# EAGLE design mute control (EAGLE 7.3.0)
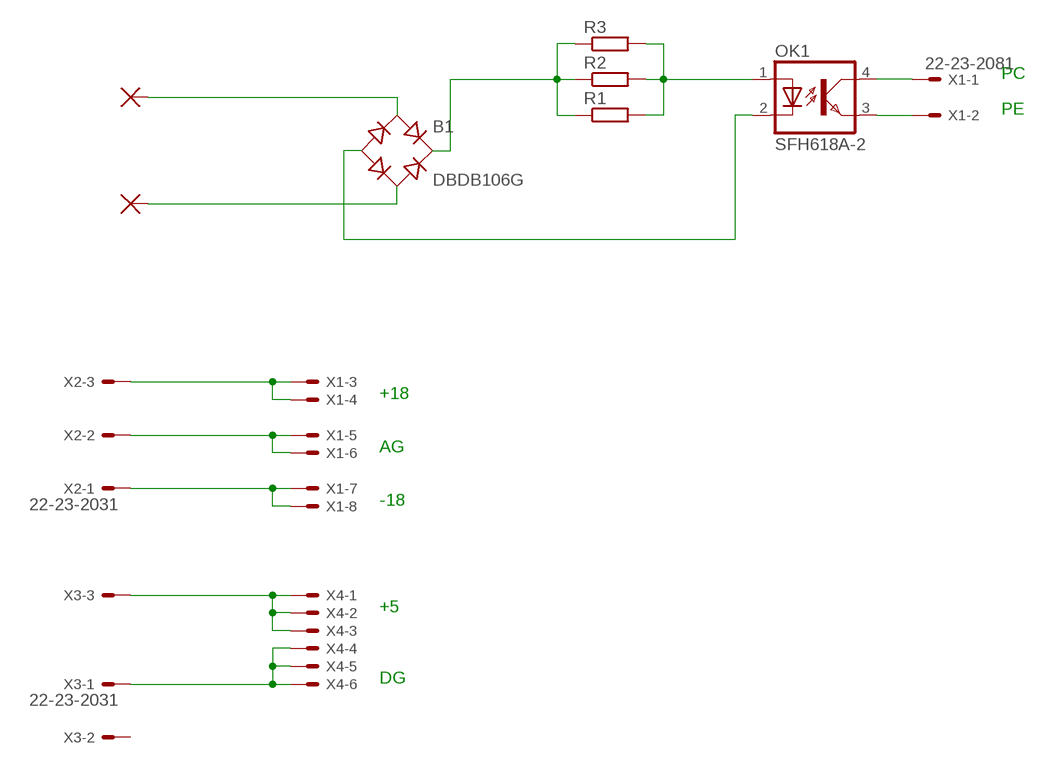
[diagram p0: schematic, sheet 1]

## Parts
AC  3,17/1,3  [OBLONG]
B1  DBDB106G  [DB]
OK1  SFH618A-2  [DIP4]
PAD1  3,17/1,3  [OBLONG]
R1  R-EU_0817/22  [P0817/22]
R2  R-EU_0817/22  [P0817/22]
R3  R-EU_0817/22  [P0817/22]
X1  22-23-2081  [22-23-2081]
X2  22-23-2031  [22-23-2031]
X3  22-23-2031  [22-23-2031]
X4  22-23-2061  [22-23-2061]

## Nets
N$1: AC.P$1(P) B1.AC2
N$2: B1.AC1 PAD1.P$1(P)
N$3: B1.+ R1.1 R2.1 R3.1
N$4: B1.- OK1.2(C)
N$5: OK1.4(COL) X1.1
N$6: OK1.3(EMIT) X1.2
N$7: X1.3 X1.4 X2.3
N$8: OK1.1(A) R1.2 R2.2 R3.2
N$9: X3.1 X4.4 X4.5 X4.6
N$10: X3.3 X4.1 X4.2 X4.3
N$11: X1.5 X1.6 X2.2
N$12: X1.7 X1.8 X2.1
Unconnected: X3.2

## Notes on the sheet
- PC
- PE
- +18
- AG
- -18
- +5
- DG

## Library data of the parts
AC PAD1 = wirepad:3,17/1,3: THROUGH-HOLE PAD
B1 = rectifier:DB?*G: Single Phase 1.0 AMP Glass Passivated Bridge Rectifier Taiwan Semiconductor Co.,Ltd. - TSC Source: http://www.taiwansemi.com/TSCbig5/ezcatfiles/cust/img/img/db101g.pdf http://www.ts.com.tw/db/pictures/modules/PDT/PDT060207001/DBLS201G.pdf
OK1 = optocoupler:SFH618?*: Optocoupler, Phototransistor Output, Low Input Current Source: Data sheet <http://www.vishay.com/docs/83673/sfh618.pdf>; MF: VISHAY/TELEFUNKEN; MPN: SFH618A-2; OC_FARNELL: 6424855; OC_NEWARK: 21H7744
R1-R3 = rcl:R-EU_: RESISTOR, European symbol
X1 = con-molex:22-23-2081: .100" (2.54mm) Center Header - 8 Pin; MF: MOLEX; MPN: 22-23-2081; OC_FARNELL: 1756826; OC_NEWARK: 01C7592
X2 X3 = con-molex:22-23-2031: .100" (2.54mm) Center Header - 3 Pin; MF: MOLEX; MPN: 22-23-2031; OC_FARNELL: 1462950; OC_NEWARK: 30C0862
X4 = con-molex:22-23-2061: .100" (2.54mm) Center Header - 6 Pin; MF: MOLEX; MPN: 22-23-2061; OC_FARNELL: 1462922; OC_NEWARK: 27C1933

## Board
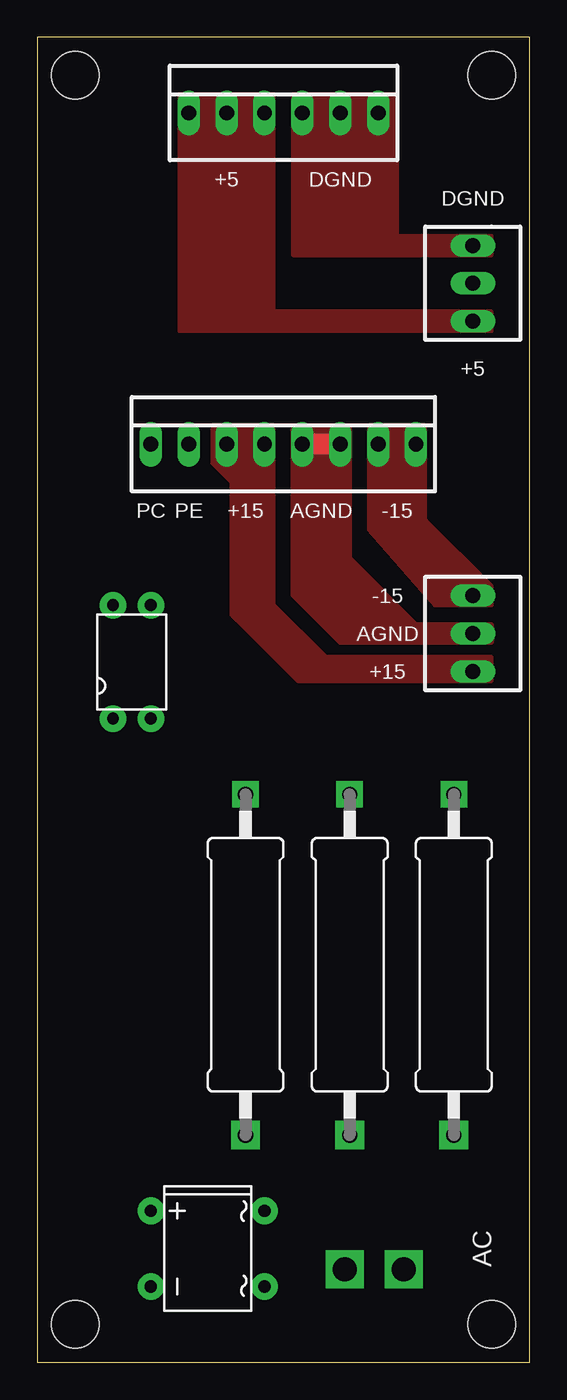
[diagram p1: board, top side]
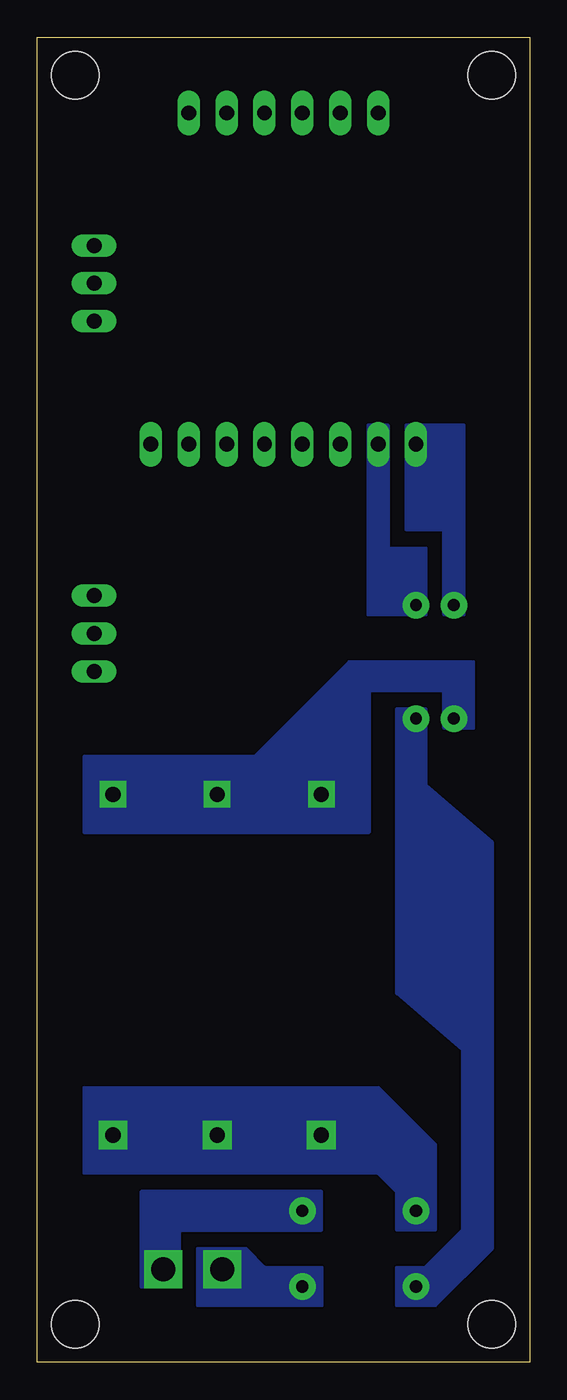
[diagram p2: board, bottom side, seen from below]

Size 33.02 x 88.9 mm. Coordinates in mm from the lower left corner, seen from the top.
Outline: 0,0 33.02,0 33.02,88.9 0,88.9 0,0
Copper layers (1*16): Top 0.035mm / dielectric 1.5mm / Bottom 0.035mm
Design rules "default": minimum track width 10mil, minimum drill 24mil, track to track 8mil, track to pad 8mil, pad to pad 8mil, via to via 8mil, smd to smd 8mil, copper to edge 40mil, drill to drill 8mil, minimum pad ring 10mil, minimum via ring 8mil, stop-mask expansion 4mil, vias tented up to drill 0mil, thermal gap 10mil
Holes 3.2 mm at 2.54,2.54 30.48,2.54 2.54,86.36 30.48,86.36

### Footprints (pad centres in the part's own frame; a part is rotated, then mirrored left to right if it is on the bottom)
OBLONG = drill 1.6 pad 2.54 square: P$1 0,0
DB = drill 0.813 pad 1.778: + -2.54,-3.81; - 2.54,-3.81; AC1 2.54,3.81; AC2 -2.54,3.81
DIP4 = drill 0.8 pad 1.778: 1 -1.27,-3.81; 2 1.27,-3.81; 3 1.27,3.81; 4 -1.27,3.81
P0817/22 = drill 1.016 pad 1.93 square: 1 -11.43,0 | drill 1.016 pad 1.778 square: 2 11.43,0
22-23-2081 = drill 1 long: 1 -8.89,0; 2 -6.35,0; 3 -3.81,0; 4 -1.27,0; 5 1.27,0; 6 3.81,0; 7 6.35,0; 8 8.89,0
22-23-2031 = drill 1 long: 1 -2.54,0; 2 0,0; 3 2.54,0
22-23-2061 = drill 1 long: 1 -6.35,0; 2 -3.81,0; 3 -1.27,0; 4 1.27,0; 5 3.81,0; 6 6.35,0

### Placement (x,y rotation side)
AC  24.58,6.24 0 top
B1  11.43,7.62 270 top
OK1  6.35,46.99 0 top
PAD1  20.62,6.24 0 top
R1  13.97,26.67 90 top
R2  27.94,26.67 90 top
R3  20.95,26.67 90 top
X1  16.51,61.59 0 top
X2  29.21,48.9 270 top
X3  29.21,72.39 270 top
X4  16.51,83.82 0 top

### Tracks (layer width: path | path; a pad name or v marks a point on that pad's centre or on a via)
N$1
  pour Bottom (no thermals): 13.97,11.43 26.04,11.43 26.04,5.08 23.5,5.08 23.5,8.89 13.97,8.89
N$2
  pour Bottom (no thermals): 22.23,7.62 19.05,7.62 17.78,6.35 13.97,6.35 13.97,3.81 22.23,3.81
N$3
  pour Bottom (no thermals): 6.35,8.89 8.89,8.89 8.89,11.43 10.16,12.7 29.84,12.7 29.84,18.41 10.16,18.41 6.35,14.61
N$4
  pour Bottom (no thermals): 8.89,3.81 8.89,6.35 6.99,6.35 4.45,8.89 4.45,20.95 8.89,24.77 8.89,43.81 6.99,43.81 6.99,38.73 2.54,34.92 2.54,7.62 6.35,3.81
N$5
  pour Bottom (no thermals): 4.45,50.16 5.71,50.16 5.71,55.88 8.26,55.88 8.26,62.87 4.45,62.87
N$6
  pour Bottom (no thermals): 6.99,50.16 10.79,50.16 10.79,62.87 9.53,62.87 9.53,54.61 6.99,54.61
N$7
  pour Top (no thermals): 30.48,47.31 19.37,47.31 15.88,50.8 15.88,62.87 11.75,62.87 11.75,60.33 13.02,59.05 13.02,50.16 17.46,45.72 30.48,45.72
N$8
  pour Bottom (no thermals): 29.84,35.56 29.84,40.64 18.41,40.64 12.06,46.99 3.81,46.99 3.81,42.55 5.71,42.55 5.71,45.09 10.79,45.09 10.79,35.56
N$9
  pour Top (no thermals): 24.13,75.56 24.13,85.09 17.14,85.09 17.14,74.3 30.48,74.3 30.48,75.56
N$10
  pour Top (no thermals): 30.48,70.48 15.88,70.48 15.88,85.09 9.53,85.09 9.53,69.22 30.48,69.22
N$11
  Top 1.422: X1.6 X1.5
  pour Top (no thermals): 30.48,48.26 20.32,48.26 17.14,51.44 17.14,62.87 20.95,62.87 20.95,53.98 25.4,49.53 30.48,49.53
N$12
  pour Top (no thermals): 30.48,52.07 26.04,56.52 26.04,62.87 22.23,62.87 22.23,55.88 26.67,50.8 30.48,50.8

### Text on the board
tNames: +5 | DGND | DGND | +5 | PC | PE | +15 | AGND | -15 | -15 | AGND | +15 | AC